# Altium schematic sheet [07]-CPU-ENET,GPIO.SchDoc: S32K1_CONTROLLER
size A3; SheetNumber: 07; SheetTotal: 11
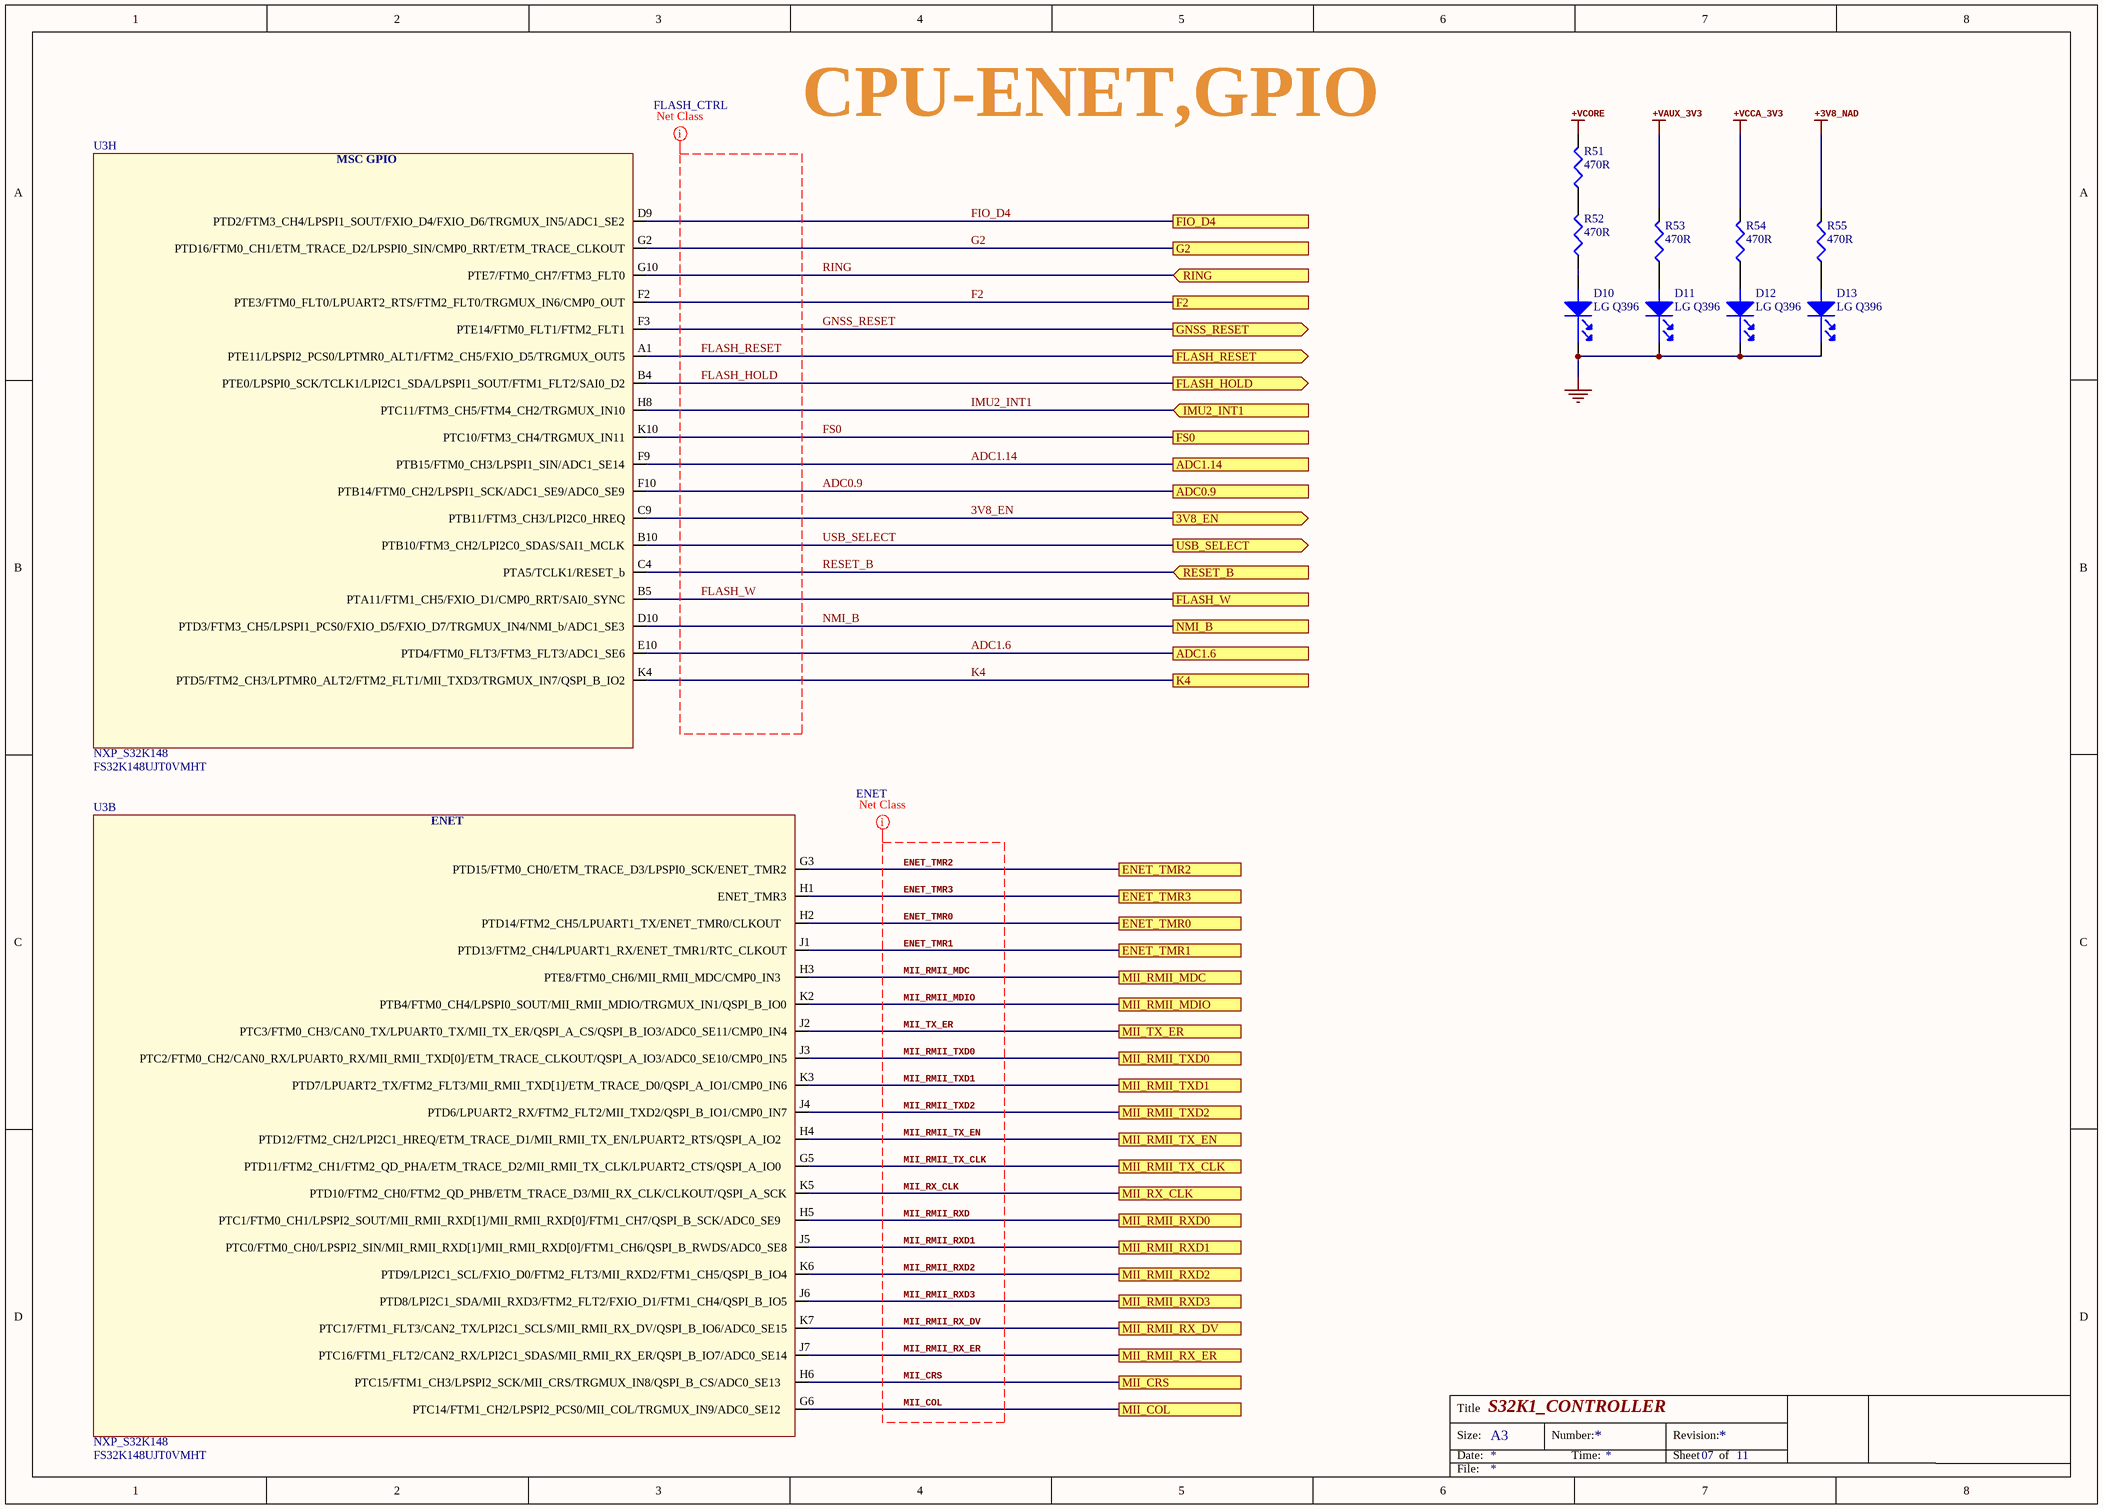
[diagram p0: [07]-CPU-ENET,GPIO.SchDoc]

## Parts
D10  LG Q396  [LED_0603]
D11  LG Q396  [LED_0603]
D12  LG Q396  [LED_0603]
D13  LG Q396  [LED_0603]
R51  Resistance: 470R  [RES0402]  (hidden comment: AC0402JR-07470RL)
R52  Resistance: 470R  [RES0402]  (hidden comment: AC0402JR-07470RL)
R53  Resistance: 470R  [RES0402]  (hidden comment: AC0402JR-07470RL)
R54  Resistance: 470R  [RES0402]  (hidden comment: AC0402JR-07470RL)
R55  Resistance: 470R  [RES0402]  (hidden comment: AC0402JR-07470RL)
U3  NXP_S32K148  Manufacturer Part Number: FS32K148UJT0VMHT  [WEONREFERENCEPLATFORM_100MAPBGA]  (parts B,H of 8)

## Ports
3V8_EN (out), ADC0.9, ADC1.6, ADC1.14, ENET_TMR0, ENET_TMR1, ENET_TMR2, ENET_TMR3, F2, FIO_D4, FLASH_HOLD (out), FLASH_RESET (out), FLASH_W, FS0, G2, GNSS_RESET (out), IMU2_INT1 (in), K4, MII_COL, MII_CRS, MII_RMII_MDC, MII_RMII_MDIO, MII_RMII_RX_DV, MII_RMII_RX_ER, MII_RMII_RXD0, MII_RMII_RXD1, MII_RMII_RXD2, MII_RMII_RXD3, MII_RMII_TX_CLK, MII_RMII_TX_EN, MII_RMII_TXD0, MII_RMII_TXD1, MII_RMII_TXD2, MII_RX_CLK, MII_TX_ER, NMI_B, RESET_B (in), RING (in), USB_SELECT (out)

## Nets
+3V8_NAD: R55.2
+VAUX_3V3: R53.2
+VCCA_3V3: R54.2
+VCORE: R51.2
GND: D10.1(cathode) D11.1(cathode) D12.1(cathode) D13.1(cathode)
3V8_EN: U3.C9(PTB11/FTM3_CH3/LPI2C0_HREQ) ; port 3V8_EN
ADC0.9: U3.F10(PTB14/FTM0_CH2/LPSPI1_SCK/ADC1_SE9/ADC0_SE9) ; port ADC0.9
ADC1.6: U3.E10(PTD4/FTM0_FLT3/FTM3_FLT3/ADC1_SE6) ; port ADC1.6
ADC1.14: U3.F9(PTB15/FTM0_CH3/LPSPI1_SIN/ADC1_SE14) ; port ADC1.14
ENET_TMR0: U3.H2(PTD14/FTM2_CH5/LPUART1_TX/ENET_TMR0/CLKOUT) ; port ENET_TMR0
ENET_TMR1: U3.J1(PTD13/FTM2_CH4/LPUART1_RX/ENET_TMR1/RTC_CLKOUT) ; port ENET_TMR1
ENET_TMR2: U3.G3(PTD15/FTM0_CH0/ETM_TRACE_D3/LPSPI0_SCK/ENET_TMR2) ; port ENET_TMR2
ENET_TMR3: U3.H1(ENET_TMR3) ; port ENET_TMR3
F2: U3.F2(PTE3/FTM0_FLT0/LPUART2_RTS/FTM2_FLT0/TRGMUX_IN6/CMP0_OUT) ; port F2
FIO_D4: U3.D9(PTD2/FTM3_CH4/LPSPI1_SOUT/FXIO_D4/FXIO_D6/TRGMUX_IN5/ADC1_SE2) ; port FIO_D4
FLASH_HOLD: U3.B4(PTE0/LPSPI0_SCK/TCLK1/LPI2C1_SDA/LPSPI1_SOUT/FTM1_FLT2/SAI0_D2) ; port FLASH_HOLD
FLASH_RESET: U3.A1(PTE11/LPSPI2_PCS0/LPTMR0_ALT1/FTM2_CH5/FXIO_D5/TRGMUX_OUT5) ; port FLASH_RESET
FLASH_W: U3.B5(PTA11/FTM1_CH5/FXIO_D1/CMP0_RRT/SAI0_SYNC) ; port FLASH_W
FS0: U3.K10(PTC10/FTM3_CH4/TRGMUX_IN11) ; port FS0
G2: U3.G2(PTD16/FTM0_CH1/ETM_TRACE_D2/LPSPI0_SIN/CMP0_RRT/ETM_TRACE_CLKOUT) ; port G2
GNSS_RESET: U3.F3(PTE14/FTM0_FLT1/FTM2_FLT1) ; port GNSS_RESET
IMU2_INT1: U3.H8(PTC11/FTM3_CH5/FTM4_CH2/TRGMUX_IN10) ; port IMU2_INT1
K4: U3.K4(PTD5/FTM2_CH3/LPTMR0_ALT2/FTM2_FLT1/MII_TXD3/TRGMUX_IN7/QSPI_B_IO2) ; port K4
MII_COL: U3.G6(PTC14/FTM1_CH2/LPSPI2_PCS0/MII_COL/TRGMUX_IN9/ADC0_SE12) ; port MII_COL
MII_CRS: U3.H6(PTC15/FTM1_CH3/LPSPI2_SCK/MII_CRS/TRGMUX_IN8/QSPI_B_CS/ADC0_SE13) ; port MII_CRS
MII_RMII_MDC: U3.H3(PTE8/FTM0_CH6/MII_RMII_MDC/CMP0_IN3) ; port MII_RMII_MDC
MII_RMII_MDIO: U3.K2(PTB4/FTM0_CH4/LPSPI0_SOUT/MII_RMII_MDIO/TRGMUX_IN1/QSPI_B_IO0) ; port MII_RMII_MDIO
MII_RMII_RX_DV: U3.K7(PTC17/FTM1_FLT3/CAN2_TX/LPI2C1_SCLS/MII_RMII_RX_DV/QSPI_B_IO6/ADC0_SE15) ; port MII_RMII_RX_DV
MII_RMII_RX_ER: U3.J7(PTC16/FTM1_FLT2/CAN2_RX/LPI2C1_SDAS/MII_RMII_RX_ER/QSPI_B_IO7/ADC0_SE14) ; port MII_RMII_RX_ER
MII_RMII_RXD: U3.H5(PTC1/FTM0_CH1/LPSPI2_SOUT/MII_RMII_RXD[1]/MII_RMII_RXD[0]/FTM1_CH7/QSPI_B_SCK/ADC0_SE9) ; port MII_RMII_RXD0
MII_RMII_RXD1: U3.J5(PTC0/FTM0_CH0/LPSPI2_SIN/MII_RMII_RXD[1]/MII_RMII_RXD[0]/FTM1_CH6/QSPI_B_RWDS/ADC0_SE8) ; port MII_RMII_RXD1
MII_RMII_RXD2: U3.K6(PTD9/LPI2C1_SCL/FXIO_D0/FTM2_FLT3/MII_RXD2/FTM1_CH5/QSPI_B_IO4) ; port MII_RMII_RXD2
MII_RMII_RXD3: U3.J6(PTD8/LPI2C1_SDA/MII_RXD3/FTM2_FLT2/FXIO_D1/FTM1_CH4/QSPI_B_IO5) ; port MII_RMII_RXD3
MII_RMII_TX_CLK: U3.G5(PTD11/FTM2_CH1/FTM2_QD_PHA/ETM_TRACE_D2/MII_RMII_TX_CLK/LPUART2_CTS/QSPI_A_IO0) ; port MII_RMII_TX_CLK
MII_RMII_TX_EN: U3.H4(PTD12/FTM2_CH2/LPI2C1_HREQ/ETM_TRACE_D1/MII_RMII_TX_EN/LPUART2_RTS/QSPI_A_IO2) ; port MII_RMII_TX_EN
MII_RMII_TXD0: U3.J3(PTC2/FTM0_CH2/CAN0_RX/LPUART0_RX/MII_RMII_TXD[0]/ETM_TRACE_CLKOUT/QSPI_A_IO3/ADC0_SE10/CMP0_IN5) ; port MII_RMII_TXD0
MII_RMII_TXD1: U3.K3(PTD7/LPUART2_TX/FTM2_FLT3/MII_RMII_TXD[1]/ETM_TRACE_D0/QSPI_A_IO1/CMP0_IN6) ; port MII_RMII_TXD1
MII_RMII_TXD2: U3.J4(PTD6/LPUART2_RX/FTM2_FLT2/MII_TXD2/QSPI_B_IO1/CMP0_IN7) ; port MII_RMII_TXD2
MII_RX_CLK: U3.K5(PTD10/FTM2_CH0/FTM2_QD_PHB/ETM_TRACE_D3/MII_RX_CLK/CLKOUT/QSPI_A_SCK) ; port MII_RX_CLK
MII_TX_ER: U3.J2(PTC3/FTM0_CH3/CAN0_TX/LPUART0_TX/MII_TX_ER/QSPI_A_CS/QSPI_B_IO3/ADC0_SE11/CMP0_IN4) ; port MII_TX_ER
NMI_B: U3.D10(PTD3/FTM3_CH5/LPSPI1_PCS0/FXIO_D5/FXIO_D7/TRGMUX_IN4/NMI_b/ADC1_SE3) ; port NMI_B
RESET_B: U3.C4(PTA5/TCLK1/RESET_b) ; port RESET_B
RING: U3.G10(PTE7/FTM0_CH7/FTM3_FLT0) ; port RING
USB_SELECT: U3.B10(PTB10/FTM3_CH2/LPI2C0_SDAS/SAI1_MCLK) ; port USB_SELECT
NetD10_2: D10.2(ANODE) R52.1
NetD11_2: D11.2(ANODE) R53.1
NetD12_2: D12.2(ANODE) R54.1
NetD13_2: D13.2(ANODE) R55.1
NetR51_1: R51.1 R52.2

## Layout directives
net class ENET: ENET_TMR0, ENET_TMR1, ENET_TMR2, ENET_TMR3, MII_COL, MII_CRS, MII_RMII_MDC, MII_RMII_MDIO, MII_RMII_RX_DV, MII_RMII_RX_ER, MII_RMII_RXD, MII_RMII_RXD1, MII_RMII_RXD2, MII_RMII_RXD3, MII_RMII_TX_CLK, MII_RMII_TX_EN, MII_RMII_TXD0, MII_RMII_TXD1, MII_RMII_TXD2, MII_RX_CLK, MII_TX_ER
net class FLASH_CTRL: FLASH_HOLD, FLASH_RESET, FLASH_W

## Notes on the sheet
- CPU-ENET,GPIO
- Labels drawn without touching a wire or pin: +3V8_NAD, +VAUX_3V3, +VCCA_3V3, +VCORE
- Title
- Size:
- Date:
- A3
- Number:
- Time:
- Revision:
- Sheet
- of
- File:
- (in symbol NXP_S32K148, part B) ENET
- (in symbol NXP_S32K148, part H) MSC GPIO

## Library data of the parts
D10-D13 = LG Q396: Green Led Chipled 0603 Lg Q396; Manufacturer: Osram Opto; Supplier 1: Mouser; Manufacturer Part Number: LG Q396; Stock 1: 96241; Pricing 1: 1 = 0.54000, 10 = 0.30000, 50 = 0.30000, 100 = 0.19600, 1000 = 0.08100, 10000 = 0.05100 (USD); Supplier Part Number 1: 720-LGQ396A3964
R51-R55 = AC0402JR-07470RL: Res Thick Film 0402 470 Ohm 5% 0.063W(1/16W) ±100ppm/C Epoxy Pad SMD Automotive T/R; Manufacturer: Yageo; Power Rating: 62.5mW; Voltage Rating: 50V; Max Power Dissipation: 63mW; Temperature Coefficient: 100ppm/°C; Supplier 1: Arrow; Manufacturer Part Number: AC0402JR-07470RL; Stock 1: 6600; Pricing 1: 1 = 0.00130, 250 = 0.00110 (USD); Case/Package: 0402; Case Code (Imperial): 0402; Case Code (Metric): 1005; Min Operating Temperature: -55°C; Max Operating Temperature: 155°C; Packaging: Tape and Reel; Tolerance: 5%; Composition: Thick Film; Number of Terminations: 2; Termination: SMD/SMT; Military Standard: Not; Features: Automotive AEC-Q200,Moisture Resistant; Length: 1mm; Height: 0.015inch; Width: 0.02inch; Depth: 0.5mm; ComponentLink1URL: http://datasheet.octopart.com/AC0402JR-07470RL-Yageo-datasheet-58829331.pdf?src-supplier=Future+Electronics; ComponentLink1Description: http://datasheet.octopart.com/AC0402JR-07470RL-Yageo-datasheet-58829331.pdf?src-supplier=Future+Electronics; ComponentLink2URL: http://datasheet.octopart.com/AC0402JR-07470RL-Yageo-datasheet-83209224.pdf?src-supplier=Future+Electronics; ComponentLink2Description: http://datasheet.octopart.com/AC0402JR-07470RL-Yageo-datasheet-83209224.pdf?src-supplier=Future+Electronics; ComponentLink3URL: http://datasheet.octopart.com/AC0402JR-07470RL-Yageo-datasheet-62139191.pdf?src-supplier=Future+Electronics; ComponentLink3Description: http://datasheet.octopart.com/AC0402JR-07470RL-Yageo-datasheet-62139191.pdf?src-supplier=Future+Electronics; ComponentLink4URL: http://datasheet.octopart.com/AC0402JR-07470RL-Yageo-datasheet-12512238.pdf; ComponentLink4Description: http://datasheet.octopart.com/AC0402JR-07470RL-Yageo-datasheet-12512238.pdf; Supplier Part Number 1: AC0402JR-07470RL
U3 = NXP_S32K148: Manufacturer: NXP Semiconductors; Supplier 1: Digikey; Stock 1: 855; Pricing 1: 1 = 16.32000, 10 = 14.99600, 25 = 14.37440, 100 = 12.66510, 880 = 11.26650 (USD); Supplier Part Number 1: 568-13929-ND